# EAGLE design relay004 (EAGLE 4.15)
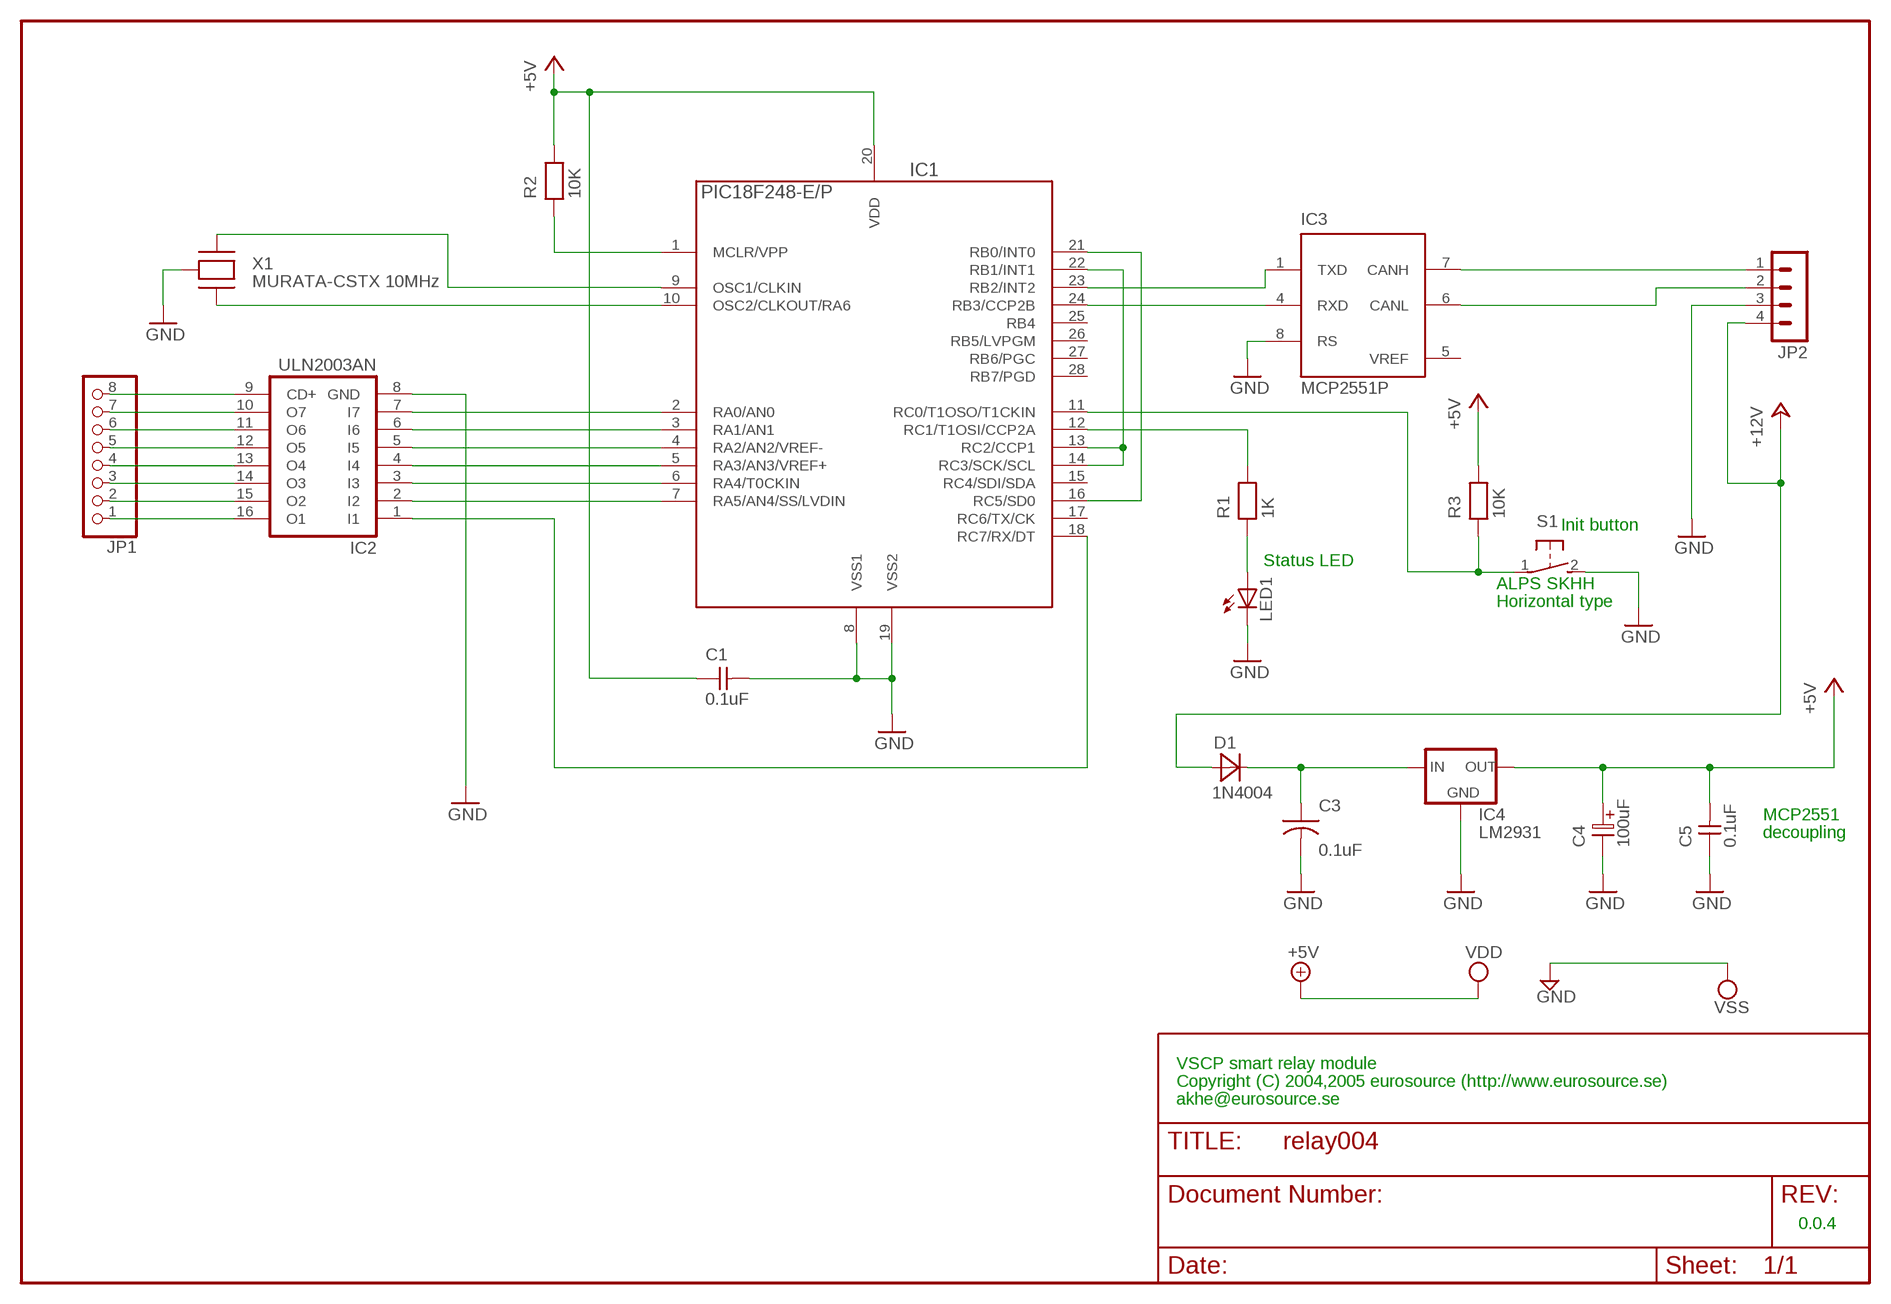
[diagram p0: schematic, sheet 1]

## Parts
C1  0.1uF  CAPNP-2,5  [C-2,5]
C3  0.1uF  CAP-5  [C-5]
C4  100uF  ELC-5  [ES-5]
C5  0.1uF  CAPNP-2,5  [C-2,5]
D1  1N4004  DIODE-10  [D-10]
IC1  PIC18F248-E/P  PIC18F252-E/P  [PDIP-28]
IC2  ULN2003AN  [DIL16]
IC3  MCP2551P  [DIL8]
IC4  LM2931  78LXX  [78LXX]
JP1  PINHD-1X8  [1X08]
JP2  MA04-1  [MA04-1]
LED1  LED3MM  [LED3MM]
R1  1K  RESEU-10  [R-10]
R2  10K  RESEU-10  [R-10]
R3  10K  RESEU-10  [R-10]
S1  31-XX  [B3F-31XX]
X1  MURATA-CSTX 10MHz  MURATA-CSTX  [RESONATOR-MURATA]

## Nets
+5V: C1.1 C4.1 C5.2 IC1.20(VDD) IC4.OUT R2.2 R3.2 ; supply symbol labelled VDD
+12V: D1.1(A) JP2.4
CANH: IC3.7(CANH) JP2.1
CANL: IC3.6(CANL) JP2.2
GND: C1.2 C3.2 C4.2 C5.1 IC1.8(VSS1) IC1.19(VSS2) IC2.8(GND) IC3.8(RS) IC4.GND JP2.3 LED1.K(C) S1.2(S) X1.2(GND) ; supply symbol labelled VSS
N$1: LED1.A R1.1
N$2: IC1.12(RC1/T1OSI/CCP2A) R1.2
N$3: IC1.10(OSC2/CLKOUT/RA6) X1.3(XTOUT)
N$4: IC1.1(MCLR/VPP) R2.1
N$5: IC2.9(CD+) JP1.8
N$6: IC1.11(RC0/T1OSO/T1CKIN) R3.1 S1.1(P)
N$7: IC2.10(O7) JP1.7
N$8: IC2.11(O6) JP1.6
N$9: IC2.12(O5) JP1.5
N$10: IC2.13(O4) JP1.4
N$11: C3.1 D1.2(K) IC4.IN
N$12: IC2.14(O3) JP1.3
N$13: IC2.15(O2) JP1.2
N$14: IC2.16(O1) JP1.1
N$15: IC1.2(RA0/AN0) IC2.7(I7)
N$16: IC1.3(RA1/AN1) IC2.6(I6)
N$17: IC1.4(RA2/AN2/VREF-) IC2.5(I5)
N$18: IC1.5(RA3/AN3/VREF+) IC2.4(I4)
N$19: IC1.6(RA4/T0CKIN) IC2.3(I3)
N$20: IC1.7(RA5/AN4/SS/LVDIN) IC2.2(I2)
N$21: IC1.16(RC5/SD0) IC1.21(RB0/INT0)
OSC1: IC1.9(OSC1/CLKIN) X1.1(XTIN)
RXCAN: IC1.24(RB3/CCP2B) IC3.4(RXD)
SCK: IC1.13(RC2/CCP1) IC1.14(RC3/SCK/SCL) IC1.22(RB1/INT1)
SDO: IC1.18(RC7/RX/DT) IC2.1(I1)
TXCAN: IC1.23(RB2/INT2) IC3.1(TXD)
Unconnected: IC1.15(RC4/SDI/SDA) IC1.17(RC6/TX/CK) IC1.25(RB4) IC1.26(RB5/LVPGM) IC1.27(RB6/PGC) IC1.28(RB7/PGD)

## Notes on the sheet
- Init button
- Status LED
- ALPS SKHH
- Horizontal type
- MCP2551
- decoupling
- VSCP smart relay module
- Copyright (C) 2004,2005 eurosource (http://www.eurosource.se)
- akhe@eurosource.se
- 0.0.4

## Power pins joined to a net without a drawn wire
+5V: IC3.3(VDD)
GND: IC3.2(VSS)
VREF: IC3.5(VREF)

## Library data of the parts
C1 C5 = discrete:CAPNP-2,5
C3 = discrete:CAP-5
C4 = discrete:ELC-5
D1 = discrete:DIODE-10
IC1 = pic18:PIC18*F252-?: 18F252, 28 pin, 32Kb prog, 1536 data, 256 EEPROM
IC2 = uln-udn:ULN2003A: DRIVER ARRAY
IC3 = microchip_can:MCP2551: High Speed CAN tranceiver
IC4 = v-reg:78LXX: VOLTAGE REGULATOR
JP1 = pinhead:PINHD-1X8: PIN HEADER
JP2 = con-lstb:MA04-1
LED1 = led:LED: LED OSRAM: - CHIPLED LG R971, LG N971, LY N971, LG Q971, LY Q971, LO R971, LY R971 LH N974, LH R974 LS Q976, LO Q976, LY Q976 LO Q996 - Hyper CHIPLED LW Q18S LB Q993, LB Q99A, LB R99A - SideLED LS A670, LO A670, LY A670, LG A670, LP A670 LB A673, LV A673, LT A673, LW A673 LH A674 LY A675 LS A676, LA A676, LO A676, LY A676, LW A676 LS A679, LY A679, LG A679 - Hyper Micro SIDELED® LS Y876, LA Y876, LO Y876, LY Y876 LT Y87S - SmartLED LW L88C, LW L88S LB L89C, LB L89S, LG L890 LS L89K, LO L89K, LY L89K LS L896, LA L896, LO L896, LY L896 - TOPLED LS T670, LO T670, LY T670, LG T670, LP T670 LSG T670, LSP T670, LSY T670, LOP T670, LYG T670 LG T671, LOG T671, LSG T671 LB T673, LV T673, LT T673, LW T673 LH T674 LS T676, LA T676, LO T676, LY T676, LB T676, LH T676, LSB T676, LW T676 LB T67C, LV T67C, LT T67C, LS T67K, LO T67K, LY T67K, LW E67C LS E67B, LA E67B, LO E67B, LY E67B, LB E67C, LV E67C, LT E67C LW T67C LS T679, LY T679, LG T679 LS T770, LO T770, LY T770, LG T770, LP T770 LB T773, LV T773, LT T773, LW T773 LH T774 LS E675, LA E675, LY E675, LS T675 LS T776, LA T776, LO T776, LY T776, LB T776 LHGB T686 LT T68C, LB T68C - Hyper Mini TOPLED® LB M676 - Mini TOPLED Santana® LG M470 LS M47K, LO M47K, LY M47K Source: http://www.osram.convergy.de/
R1-R3 = discrete:RESEU-10
S1 = switch-omron:31-XX: OMRON SWITCH
X1 = eurosource_ftdi:MURATA-CSTX

## Board
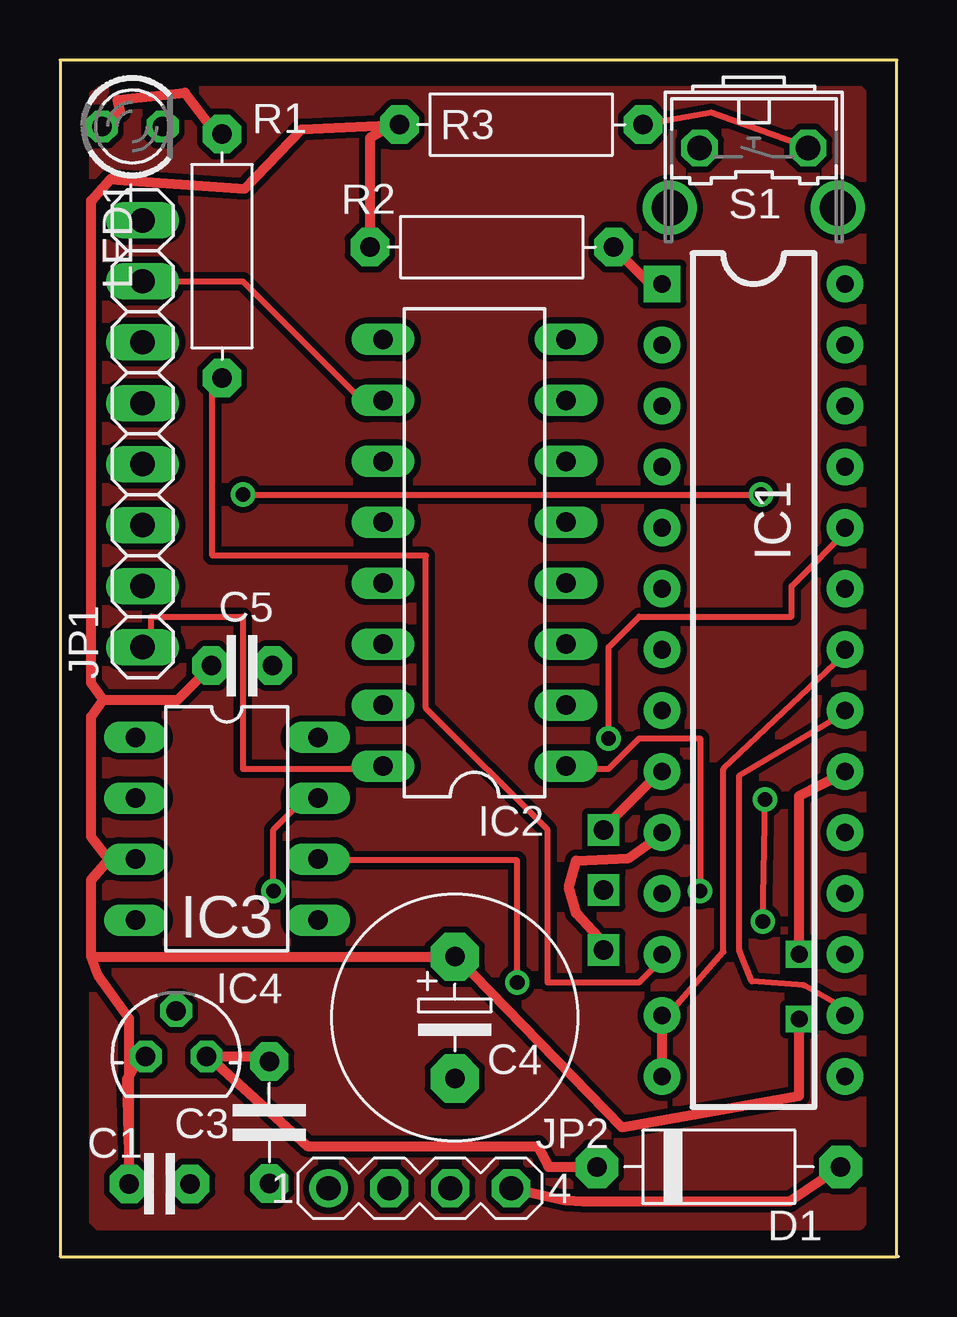
[diagram p1: board, top side]
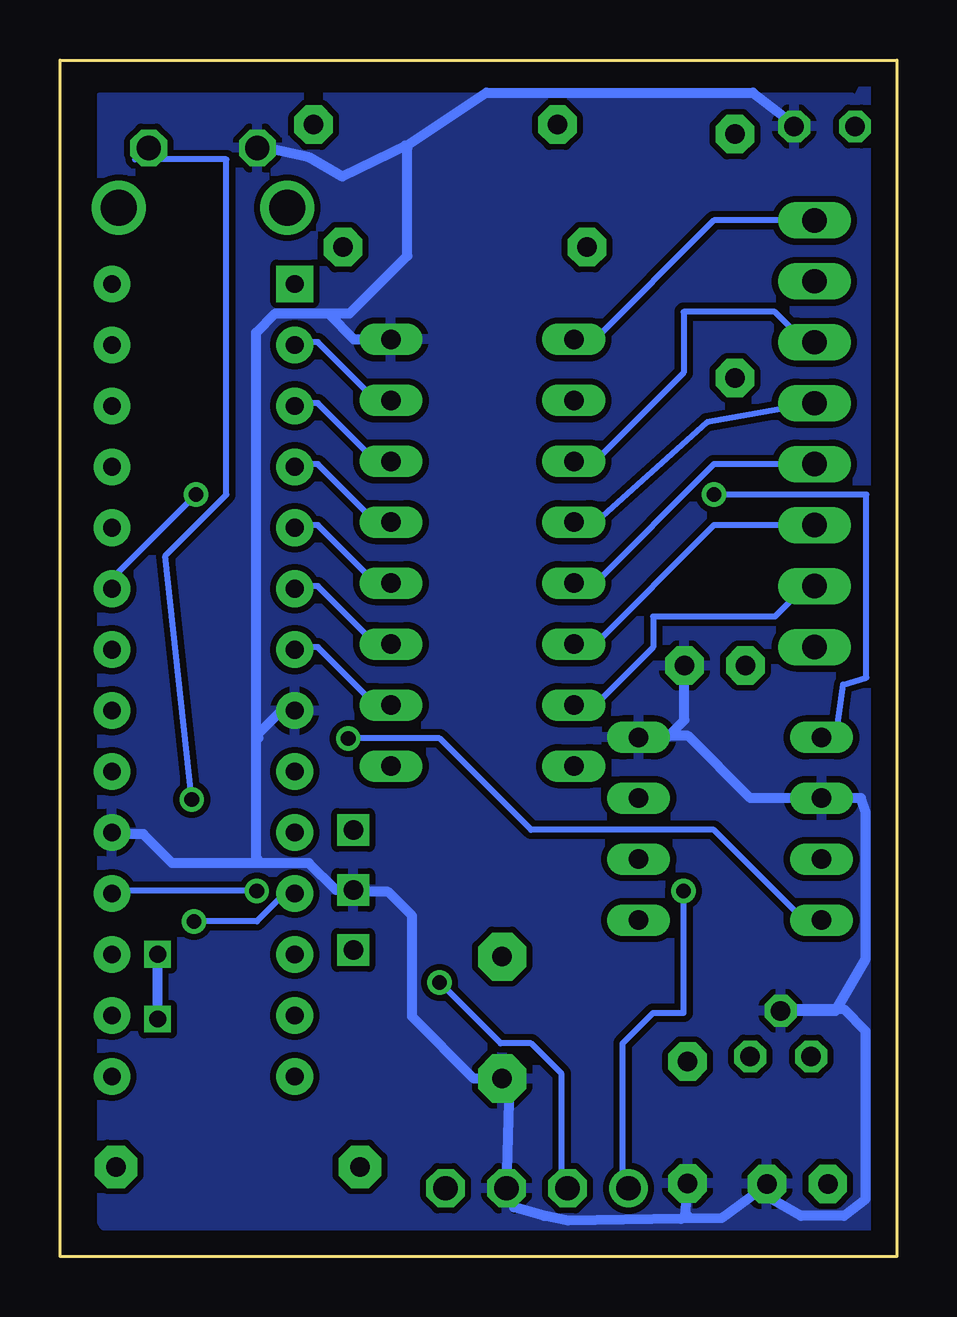
[diagram p2: board, bottom side, seen from below]

Size 34.87 x 49.86 mm. Coordinates in mm from the lower left corner, seen from the top.
Copper layers (1*16): Top 0.035mm / dielectric 1.5mm / Bottom 0.035mm
Design rules "10mils": minimum track width 10mil, minimum drill 24mil, track to track 10mil, track to pad 10mil, pad to pad 10mil, via to via 10mil, smd to smd 10mil, copper to edge 40mil, drill to drill 10mil, minimum pad ring 10mil, minimum via ring 8mil, stop-mask expansion 0mil, vias tented up to drill 0mil, thermal gap 10mil

### Footprints (pad centres in the part's own frame; a part is rotated, then mirrored left to right if it is on the bottom)
C-2,5 = drill 0.813 pad 1.6 octagon: 1 -1.27,0; 2 1.27,0
C-5 = drill 0.813 pad 1.6 octagon: 1 -2.54,0; 2 2.54,0
ES-5 = drill 0.813 pad 2.007 octagon: 1 -2.54,0; 2 2.54,0
D-10 = drill 0.813 pad 1.778 octagon: 1 -5.08,0; 2 5.08,0
PDIP-28 = drill 0.737 pad 1.524 square: 1 -17.78,-3.81 | drill 0.737 pad 1.524 round: 2 -15.24,-3.81; 3 -12.7,-3.81; 4 -10.16,-3.81; 5 -7.62,-3.81; 6 -5.08,-3.81; 7 -2.54,-3.81; 8 0,-3.81; 9 2.54,-3.81; 10 5.08,-3.81; 11 7.62,-3.81; 12 10.16,-3.81; 13 12.7,-3.81; 14 15.24,-3.81; 15 15.24,3.81; 16 12.7,3.81; 17 10.16,3.81; 18 7.62,3.81; 19 5.08,3.81; 20 2.54,3.81; 21 0,3.81; 22 -2.54,3.81; 23 -5.08,3.81; 24 -7.62,3.81; 25 -10.16,3.81; 26 -12.7,3.81; 27 -15.24,3.81; 28 -17.78,3.81
DIL16 = drill 0.813 long: 1 -8.89,-3.81; 2 -6.35,-3.81; 3 -3.81,-3.81; 4 -1.27,-3.81; 5 1.27,-3.81; 6 3.81,-3.81; 7 6.35,-3.81; 8 8.89,-3.81; 9 8.89,3.81; 10 6.35,3.81; 11 3.81,3.81; 12 1.27,3.81; 13 -1.27,3.81; 14 -3.81,3.81; 15 -6.35,3.81; 16 -8.89,3.81
DIL8 = drill 0.813 long: 1 -3.81,-3.81; 2 -1.27,-3.81; 3 1.27,-3.81; 4 3.81,-3.81; 5 3.81,3.81; 6 1.27,3.81; 7 -1.27,3.81; 8 -3.81,3.81
78LXX = drill 0.813 octagon: GND 0,1.905; IN 1.27,0; OUT -1.27,0
1X08 = drill 1.016 long: 1 -8.89,0; 2 -6.35,0; 3 -3.81,0; 4 -1.27,0; 5 1.27,0; 6 3.81,0; 7 6.35,0; 8 8.89,0
MA04-1 = drill 1.016 pad 1.6 round: 1 -3.81,0 | drill 1.016 pad 1.6 octagon: 2 -1.27,0; 3 1.27,0; 4 3.81,0
LED3MM = drill 0.813 octagon: A -1.27,0; K 1.27,0
R-10 = drill 0.813 pad 1.6 octagon: 1 -5.08,0; 2 5.08,0
B3F-31XX = drill 1.016 octagon: 1 -2.261,-1.245; 2 2.261,-1.245 | drill 1.499 pad 2.159 round: 3 -3.505,1.245; 4 3.505,1.245
RESONATOR-MURATA = drill 0.813 square: 1 0,0; 2 2.5,0; 3 5,0

### Placement (x,y rotation side)
C1  4.15,3.03 0 top
C3  8.72,5.59 270 top
C4  16.45,9.96 270 top
C5  7.58,24.63 180 top
D1  27.45,3.74 180 top
IC1  28.9,22.75 270 top
IC2  17.27,29.33 90 top
IC3  6.95,17.83 270 top
IC4  4.84,8.34 0 top
JP1  3.44,34.29 90 top
JP2  14.99,2.85 0 top
LED1  3.01,47.09 0 top
R1  6.75,41.69 270 top
R2  17.99,42.06 180 top
R3  19.22,47.17 180 top
S1  28.91,44.95 180 top
U$1  [DIN_THIN]  0,0 0 top
X1  22.65,17.78 270 top

### Tracks (layer width: path | path; a pad name or v marks a point on that pad's centre or on a via)
+5V  (via drill 0.7)
  Top 0.406: IC4.OUT 3.47,8.57 2.8,7.4 2.9,3.5 C1.1 | C1.1 2.9,3 | C1.1 2.88,9.92 1.6,11.7 1.3,12.5 | 3.24,16.56 3.3,16.5 3.2,16.4 1.9,16.4 1.3,15.7 1.3,12.5 | 3.24,16.56 IC3.3 | 1.3,12.5 C4.1 16.5,12.5 23.4,5.4 30.8,6.7 v30.8,9.9 | 3.24,16.56 2.04,16.56 1.3,17.5 1.3,22.5 1.8,23.2 | C5.2 6.31,24.61 4.9,23.2 1.8,23.2 | 1.8,23.2 1.3,23.9 1.3,44 2.1,44.9 7.7,44.5 10.07,46.97 R3.2 14.14,47.26 14.1,47.3 12.91,46.61 R2.2 | IC1.20 32.71,20.19 30.8,19.2 v30.8,12.6
  Bottom 0.406: v30.8,9.9 v30.8,12.6
+12V
  Top 0.406: JP2.4 21.05,2.35 21.8,2.3 30.4,2.3 D1.1 | D1.1 32.6,3.6 | D1.1
CANH  (via drill 0.61)
  Top 0.254: v8.89,15.24 8.89,17.78 10.16,19.05 IC3.7
  Bottom 0.254: v8.89,15.24 8.89,10.16 10.16,10.16 11.43,8.89 11.43,2.54 JP2.1
CANL  (via drill 0.61)
  Top 0.254: v19.05,11.43 19.05,16.51 11.43,16.51 IC3.6
  Bottom 0.254: v19.05,11.43 16.51,8.89 15.24,8.89 13.97,7.62 13.97,2.54 JP2.2
GND
  Bottom 0.406: 16.45,7.45 16.5,7.5 | 16.45,7.45 C4.2 17.62,7.42 20.2,10 20.2,14.2 21.2,15.2 22.6,15.2 22.68,15.28 | 16.45,7.45 16.16,6.46 JP2.3 15.95,2.05 14.7,1.7 13.7,1.5 9,1.58 | 22.68,15.28 22.7,15.3 | 22.68,15.28 X1.2 23.38,15.28 24.5,16.4 26.5,16.4 | 26.5,16.4 30.2,16.4 31.4,17.6 32.7,17.6 32.77,17.67 | 32.77,17.67 32.8,17.7 | 32.77,17.67 IC1.19 | IC1.8 25.65,22.75 26.7,21.7 | 26.7,21.6 26.7,16.6 26.5,16.4 | 26.7,21.6 26.7,21.7 | IC2.8 22.62,38.22 23.7,39.3 | 23.7,39.3 25.9,39.3 26.7,38.5 26.7,21.7 | 26.7,21.6 26.6,21.6 26.7,21.7 | 23.7,39.3 22.8,39.3 20.4,41.7 20.4,46.2 20.5,46.3 20.4,46.3 | 20.4,46.3 17.1,48.5 6,48.5 4.2,47.1 4.21,47.09 LED1.K | 9,1.58 7.3,1.6 5.4,3 C1.2 5.42,2.52 4,1.7 2.2,1.7 1.3,2.4 1.3,9.4 2.2,10.3 4.9,10.3 4.96,10.24 | 4.96,10.24 5,10.2 | 4.96,10.24 IC4.GND 2.56,10.24 1.3,12.4 1.3,18.5 1.5,19.1 3.1,19.1 3.14,19.06 | 3.14,19.06 3.2,19 | 3.14,19.06 IC3.2 6.1,19.1 8.7,21.7 9.5,21.7 | IC3.8 10.84,21.64 10.9,21.7 9.5,21.7 | C5.1 8.85,22.35 9.5,21.7 | 8.7,1.7 | 9,1.58 8.7,1.7 | C3.2 8.82,1.68 8.7,1.7 | S1.2 26.7,46.2 26.8,46.3 24.5,45.8 23.1,45 20.4,46.3
  pour Bottom: 1.3,48.9 1.3,1.1 32.8,1.1 33.1,1.4 33.1,48.2 33.2,48.3 1.9,48.3 1.7,48.1
N$1
  Top 0.406: R1.1 6.13,47.27 5.2,48.5 2.4,48.2 2.5,47.7 1.4,47.1 1.41,47.09 LED1.A
N$2
  Top 0.254: IC1.12 25.4,12.7 24.13,11.43 20.32,11.43 20.32,17.78 15.24,22.86 15.24,29.21 6.35,29.21 6.35,36.83 R1.2
N$3
  Top 0.406: X1.3 22.65,13.05 21.5,14.3 21.2,15.4 21.5,16.5 23.7,16.6 25.1,17.6 25.09,17.61 IC1.10
N$4
  Top 0.406: R2.1 23.07,42.03 24.57,40.53 IC1.1
N$5
  Bottom 0.254: IC2.9 12.7,38.1 7.62,43.18 JP1.8
N$6  (via drill 0.61)
  Top 0.254: S1.1 31.2,46.2 27.13,47.67 R3.1 | v29.28,13.97 v29.38,19.05
  Bottom 0.254: v29.28,13.97 26.67,13.97 25.4,15.24 IC1.11 | v29.38,19.05 30.48,29.21 27.94,31.75 27.94,45.72 31.75,45.72 S1.1
N$7
  Top 0.254: IC2.10 12.7,35.56 7.62,40.64 JP1.7
N$8
  Bottom 0.254: IC2.11 12.7,33.02 8.89,36.83 8.89,39.37 5.08,39.37 3.81,38.1 JP1.6
N$9
  Bottom 0.254: IC2.12 12.7,30.48 7.92,34.76 JP1.5
N$10
  Bottom 0.254: IC2.13 12.7,27.94 7.62,33.02 JP1.4
N$11
  Top 0.406: D1.2 20.36,3.74 19.9,4.6 10.3,4.6 6.11,8.39 | 6.11,8.39 6.1,8.4 | 6.11,8.39 IC4.IN 8.46,8.34 8.7,8.1 C3.1
N$12
  Bottom 0.254: IC2.14 12.7,25.4 7.62,30.48 JP1.3
N$13
  Bottom 0.254: IC2.15 12.7,22.86 10.16,25.4 10.16,26.67 5.08,26.67 3.81,27.94 JP1.2
N$14
  Top 0.254: IC2.16 12.7,20.32 7.62,20.32 7.62,26.67 3.81,26.67 3.81,25.4 JP1.1
N$15
  Bottom 0.254: IC2.7 21.59,35.56 24.13,38.1 25.4,38.1 IC1.2
N$16
  Bottom 0.254: IC2.6 21.59,33.02 24.13,35.56 25.4,35.56 IC1.3
N$17
  Bottom 0.254: IC2.5 21.59,30.48 24.13,33.02 25.4,33.02 IC1.4
N$18
  Bottom 0.254: IC2.4 21.59,27.94 24.13,30.48 25.4,30.48 IC1.5
N$19
  Bottom 0.254: IC2.3 21.59,25.4 24.13,27.94 25.4,27.94 IC1.6
N$20
  Bottom 0.254: IC2.2 21.59,22.86 24.13,25.4 25.4,25.4 IC1.7
N$21
  Top 0.254: IC1.16 33.02,10.16 31,11.3 28.83,11.47 28.31,12.77 28.31,20.05 33.02,22.86 IC1.21
OSC1
  Top 0.406: 25.09,20.29 25.1,20.3 | 25.09,20.29 IC1.9 | X1.1 22.65,17.85 25.09,20.29
RXCAN  (via drill 0.61)
  Top 0.254: v22.86,21.59 22.86,25.4 24.13,26.67 30.48,26.67 30.48,27.94 33.02,30.48 IC1.24
  Bottom 0.254: v22.86,21.59 19.05,21.59 15.24,17.78 7.62,17.78 3.81,13.97 IC3.4
SCK
  Top 0.254: IC1.22 33.02,25.4 27.64,20.32 27.64,12.7 25.4,10.16 IC1.13
  Top 0.406: IC1.13 25.09,10.01 25.1,10 25.09,9.99 IC1.14
SDO  (via drill 0.61)
  Top 0.254: v26.67,15.24 26.67,21.59 24.13,21.59 22.86,20.32 21.59,20.32 IC2.1
  Bottom 0.254: v26.67,15.24 33.02,15.24 IC1.18
TXCAN  (via drill 0.61)
  Top 0.254: v7.62,31.75 v29.21,31.75
  Bottom 0.254: v7.62,31.75 1.27,31.75 1.27,24.13 2.24,23.83 2.54,21.59 IC3.1 | v29.21,31.75 33.02,27.94 IC1.23
VCC
  pour Top: 1.4,48.4 1.4,1.5 1.6,1.3 33.3,1.3 33.4,1.4 33.4,48.5 33.3,48.6 1.7,48.6 1.4,48.3